# Altium schematic sheet S7CAS-PLEIADES-CARTE-MERE_P01_CAN.SchDoc
size Tabloid; DocumentNumber: 7; SheetNumber: 7; SheetTotal: 17; Sheet_Name: CAN; Size: 11x17
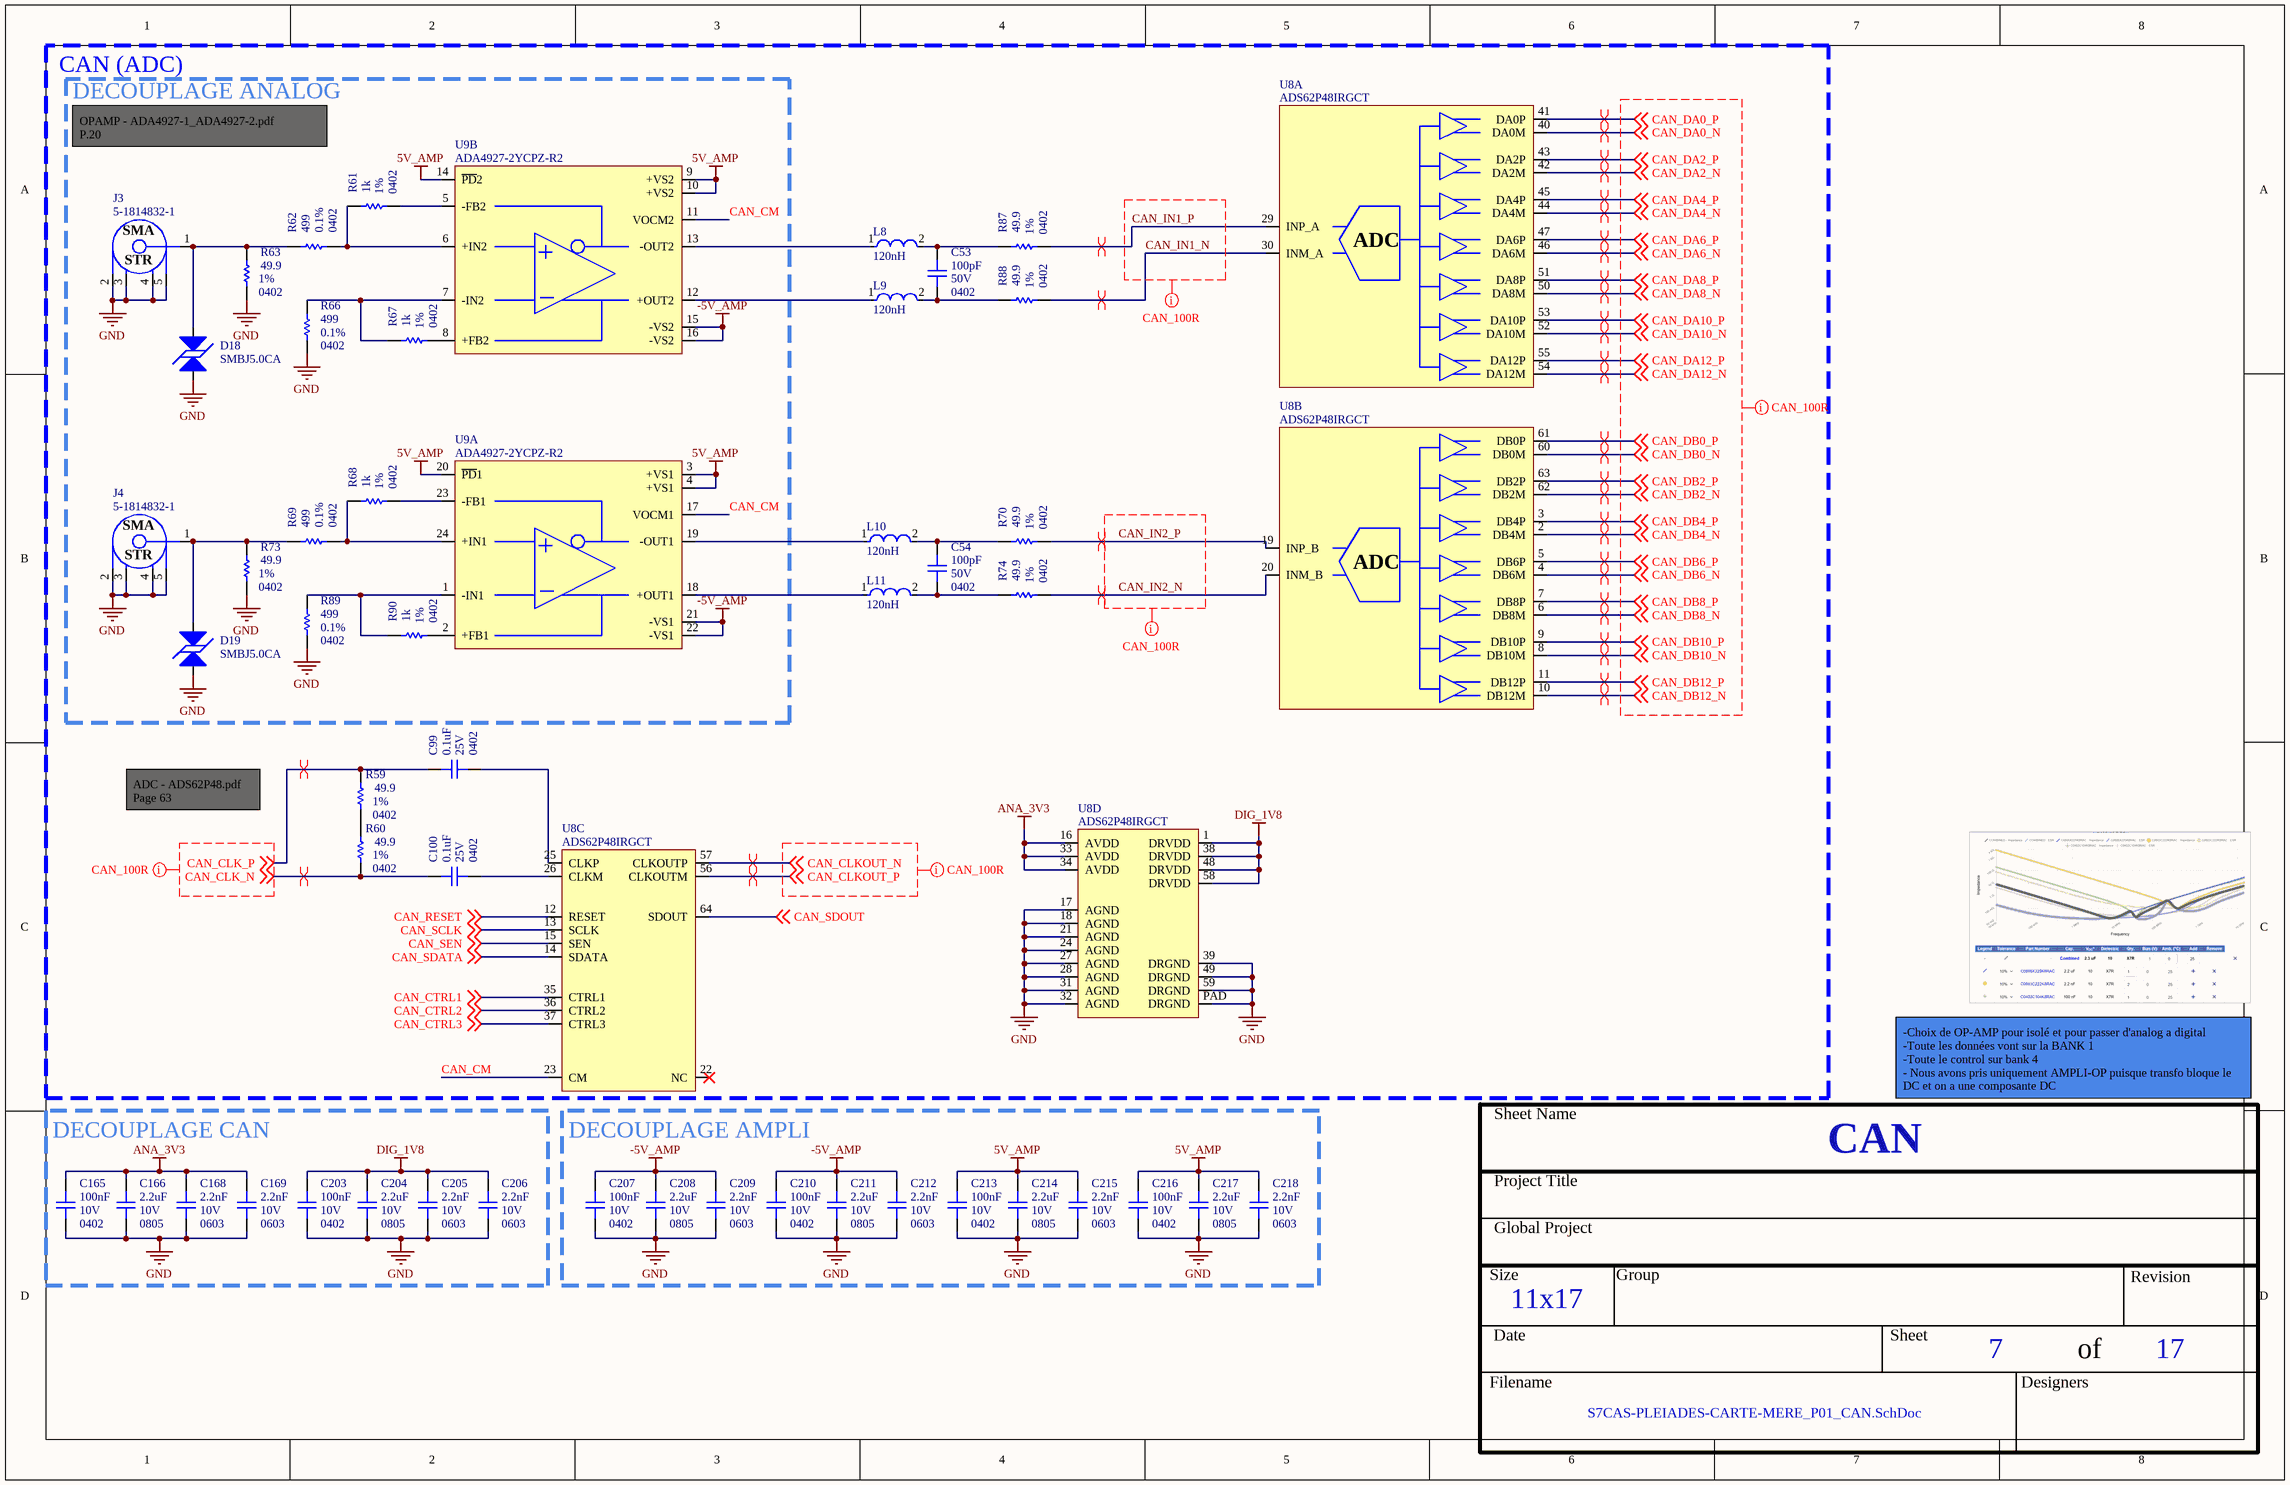
[diagram p0: S7CAS-PLEIADES-CARTE-MERE_P01_CAN.SchDoc]

## Parts
C53  value 100pF  Voltage: 50V  Package: 0402  [CAP_0402]  (hidden comment: CAP - 0402)
C54  value 100pF  Voltage: 50V  Package: 0402  [CAP_0402]  (hidden comment: CAP - 0402)
C99  value 0.1uF  Voltage: 25V  Package: 0402  [CAP_0402]  (hidden comment: CAP - 0402)
C100  value 0.1uF  Voltage: 25V  Package: 0402  [CAP_0402]  (hidden comment: CAP - 0402)
C165  value 100nF  Voltage: 10V  Package: 0402  [CAP_0402]  (hidden comment: CAP - 0402)
C166  value 2.2uF  Voltage: 10V  Package: 0805  [CAP_0805]  (hidden comment: CAP - 0805)
C168  value 2.2nF  Voltage: 10V  Package: 0603  [CAP_0603]  (hidden comment: CAP - 0603)
C169  value 2.2nF  Voltage: 10V  Package: 0603  [CAP_0603]  (hidden comment: CAP - 0603)
C203  value 100nF  Voltage: 10V  Package: 0402  [CAP_0402]  (hidden comment: CAP - 0402)
C204  value 2.2uF  Voltage: 10V  Package: 0805  [CAP_0805]  (hidden comment: CAP - 0805)
C205  value 2.2nF  Voltage: 10V  Package: 0603  [CAP_0603]  (hidden comment: CAP - 0603)
C206  value 2.2nF  Voltage: 10V  Package: 0603  [CAP_0603]  (hidden comment: CAP - 0603)
C207  value 100nF  Voltage: 10V  Package: 0402  [CAP_0402]  (hidden comment: CAP - 0402)
C208  value 2.2uF  Voltage: 10V  Package: 0805  [CAP_0805]  (hidden comment: CAP - 0805)
C209  value 2.2nF  Voltage: 10V  Package: 0603  [CAP_0603]  (hidden comment: CAP - 0603)
C210  value 100nF  Voltage: 10V  Package: 0402  [CAP_0402]  (hidden comment: CAP - 0402)
C211  value 2.2uF  Voltage: 10V  Package: 0805  [CAP_0805]  (hidden comment: CAP - 0805)
C212  value 2.2nF  Voltage: 10V  Package: 0603  [CAP_0603]  (hidden comment: CAP - 0603)
C213  value 100nF  Voltage: 10V  Package: 0402  [CAP_0402]  (hidden comment: CAP - 0402)
C214  value 2.2uF  Voltage: 10V  Package: 0805  [CAP_0805]  (hidden comment: CAP - 0805)
C215  value 2.2nF  Voltage: 10V  Package: 0603  [CAP_0603]  (hidden comment: CAP - 0603)
C216  value 100nF  Voltage: 10V  Package: 0402  [CAP_0402]  (hidden comment: CAP - 0402)
C217  value 2.2uF  Voltage: 10V  Package: 0805  [CAP_0805]  (hidden comment: CAP - 0805)
C218  value 2.2nF  Voltage: 10V  Package: 0603  [CAP_0603]  (hidden comment: CAP - 0603)
D18  SMBJ5.0CA  [TVS_PWR_SMBJ5.0CA]
D19  SMBJ5.0CA  [TVS_PWR_SMBJ5.0CA]
J3  5-1814832-1  [CONN_SMA_5-1814832-1]
J4  5-1814832-1  [CONN_SMA_5-1814832-1]
L8  120nH  [FP-0603HP-MFG]
L9  120nH  [FP-0603HP-MFG]
L10  120nH  [FP-0603HP-MFG]
L11  120nH  [FP-0603HP-MFG]
R59  value 49.9  Package: 0402  Precision: 1%  [RES_0402]  (hidden comment: RES - 0402)
R60  value 49.9  Package: 0402  Precision: 1%  [RES_0402]  (hidden comment: RES - 0402)
R61  value 1k  Package: 0402  Precision: 1%  [RES_0402]  (hidden comment: RES - 0402)
R62  value 499  Package: 0402  Precision: 0.1%  [RES_0402]  (hidden comment: RES - 0402)
R63  value 49.9  Package: 0402  Precision: 1%  [RES_0402]  (hidden comment: RES - 0402)
R66  value 499  Package: 0402  Precision: 0.1%  [RES_0402]  (hidden comment: RES - 0402)
R67  value 1k  Package: 0402  Precision: 1%  [RES_0402]  (hidden comment: RES - 0402)
R68  value 1k  Package: 0402  Precision: 1%  [RES_0402]  (hidden comment: RES - 0402)
R69  value 499  Package: 0402  Precision: 0.1%  [RES_0402]  (hidden comment: RES - 0402)
R70  value 49.9  Package: 0402  Precision: 1%  [RES_0402]  (hidden comment: RES - 0402)
R73  value 49.9  Package: 0402  Precision: 1%  [RES_0402]  (hidden comment: RES - 0402)
R74  value 49.9  Package: 0402  Precision: 1%  [RES_0402]  (hidden comment: RES - 0402)
R87  value 49.9  Package: 0402  Precision: 1%  [RES_0402]  (hidden comment: RES - 0402)
R88  value 49.9  Package: 0402  Precision: 1%  [RES_0402]  (hidden comment: RES - 0402)
R89  value 499  Package: 0402  Precision: 0.1%  [RES_0402]  (hidden comment: RES - 0402)
R90  value 1k  Package: 0402  Precision: 1%  [RES_0402]  (hidden comment: RES - 0402)
U8  ADS62P48IRGCT  [ADC_ADS62P48IRGCT]  (parts A,B,C,D of 4)
U9  ADA4927-2YCPZ-R2  [OPAMP_ADA4927-2YCPZ-R2]  (parts A,B of 2)

## Blocks framed on the sheet
CAN (ADC): C53 C54 C99 C100 L8-L11 R59 R60 R70 R74 R87 R88 U8
DECOUPLAGE ANALOG: D18 D19 J3 J4 R61-R63 R66-R69 R73 R89 R90 U9
DECOUPLAGE CAN: C165 C166 C168 C169 C203-C206
DECOUPLAGE AMPLI: C207-C218

## Nets
5V_AMP: C213.2 C214.2 C215.2 C216.2 C217.2 C218.2 U9.3(+VS1) U9.4(+VS1) U9.9(+VS2) U9.10(+VS2) U9.14(~{PD}2) U9.20(~{PD}1)
-5V_AMP: C207.2 C208.2 C209.2 C210.2 C211.2 C212.2 U9.15(-VS2) U9.16(-VS2) U9.21(-VS1) U9.22(-VS1)
ANA_3V3: C165.2 C166.2 C168.2 C169.2 U8.16(AVDD) U8.33(AVDD) U8.34(AVDD)
DIG_1V8: C203.2 C204.2 C205.2 C206.2 U8.1(DRVDD) U8.38(DRVDD) U8.48(DRVDD) U8.58(DRVDD)
GND: C165.1 C166.1 C168.1 C169.1 C203.1 C204.1 C205.1 C206.1 C207.1 C208.1 C209.1 C210.1 C211.1 C212.1 C213.1 C214.1 C215.1 C216.1 C217.1 C218.1 D18.2 D19.2 J3.2 J3.3 J3.4 J3.5 J4.2 J4.3 J4.4 J4.5 R63.1 R66.1 R73.1 R89.1 U8.17(AGND) U8.18(AGND) U8.21(AGND) U8.24(AGND) U8.27(AGND) U8.28(AGND) U8.31(AGND) U8.32(AGND) U8.39(DRGND) U8.49(DRGND) U8.59(DRGND) U8.PAD(DRGND)
CAN_CLK_N: C100.2 R60.1 ; off-sheet CAN_CLK_N
CAN_CLK_P: C99.2 R59.2 ; off-sheet CAN_CLK_P
CAN_CLKOUT_N: U8.57(CLKOUTP) ; off-sheet CAN_CLKOUT_N
CAN_CLKOUT_P: U8.56(CLKOUTM) ; off-sheet CAN_CLKOUT_P
CAN_CM: U8.23(CM) U9.11(VOCM2) U9.17(VOCM1)
CAN_CTRL1: U8.35(CTRL1) ; off-sheet CAN_CTRL1
CAN_CTRL2: U8.36(CTRL2) ; off-sheet CAN_CTRL2
CAN_CTRL3: U8.37(CTRL3) ; off-sheet CAN_CTRL3
CAN_DA0_N: U8.40(DA0M) ; off-sheet CAN_DA0_N
CAN_DA0_P: U8.41(DA0P) ; off-sheet CAN_DA0_P
CAN_DA2_N: U8.42(DA2M) ; off-sheet CAN_DA2_N
CAN_DA2_P: U8.43(DA2P) ; off-sheet CAN_DA2_P
CAN_DA4_N: U8.44(DA4M) ; off-sheet CAN_DA4_N
CAN_DA4_P: U8.45(DA4P) ; off-sheet CAN_DA4_P
CAN_DA6_N: U8.46(DA6M) ; off-sheet CAN_DA6_N
CAN_DA6_P: U8.47(DA6P) ; off-sheet CAN_DA6_P
CAN_DA8_N: U8.50(DA8M) ; off-sheet CAN_DA8_N
CAN_DA8_P: U8.51(DA8P) ; off-sheet CAN_DA8_P
CAN_DA10_N: U8.52(DA10M) ; off-sheet CAN_DA10_N
CAN_DA10_P: U8.53(DA10P) ; off-sheet CAN_DA10_P
CAN_DA12_N: U8.54(DA12M) ; off-sheet CAN_DA12_N
CAN_DA12_P: U8.55(DA12P) ; off-sheet CAN_DA12_P
CAN_DB0_N: U8.60(DB0M) ; off-sheet CAN_DB0_N
CAN_DB0_P: U8.61(DB0P) ; off-sheet CAN_DB0_P
CAN_DB2_N: U8.62(DB2M) ; off-sheet CAN_DB2_N
CAN_DB2_P: U8.63(DB2P) ; off-sheet CAN_DB2_P
CAN_DB4_N: U8.2(DB4M) ; off-sheet CAN_DB4_N
CAN_DB4_P: U8.3(DB4P) ; off-sheet CAN_DB4_P
CAN_DB6_N: U8.4(DB6M) ; off-sheet CAN_DB6_N
CAN_DB6_P: U8.5(DB6P) ; off-sheet CAN_DB6_P
CAN_DB8_N: U8.6(DB8M) ; off-sheet CAN_DB8_N
CAN_DB8_P: U8.7(DB8P) ; off-sheet CAN_DB8_P
CAN_DB10_N: U8.8(DB10M) ; off-sheet CAN_DB10_N
CAN_DB10_P: U8.9(DB10P) ; off-sheet CAN_DB10_P
CAN_DB12_N: U8.10(DB12M) ; off-sheet CAN_DB12_N
CAN_DB12_P: U8.11(DB12P) ; off-sheet CAN_DB12_P
CAN_IN1_N: R88.1 U8.30(INM_A)
CAN_IN1_P: R87.1 U8.29(INP_A)
CAN_IN2_N: R74.1 U8.20(INM_B)
CAN_IN2_P: R70.1 U8.19(INP_B)
CAN_RESET: U8.12(RESET) ; off-sheet CAN_RESET
CAN_SCLK: U8.13(SCLK) ; off-sheet CAN_SCLK
CAN_SDATA: U8.14(SDATA) ; off-sheet CAN_SDATA
CAN_SDOUT: U8.64(SDOUT) ; off-sheet CAN_SDOUT
CAN_SEN: U8.15(SEN) ; off-sheet CAN_SEN
NetC53_1: C53.1 L9.2 R88.2
NetC53_2: C53.2 L8.2 R87.2
NetC54_1: C54.1 L11.2 R74.2
NetC54_2: C54.2 L10.2 R70.2
NetC99_1: C99.1 U8.25(CLKP)
NetC100_1: C100.1 U8.26(CLKM)
NetD18_1: D18.1 J3.1 R62.2 R63.2
NetD19_1: D19.1 J4.1 R69.2 R73.2
NetL8_1: L8.1 U9.13(-OUT2)
NetL9_1: L9.1 U9.12(+OUT2)
NetL10_1: L10.1 U9.19(-OUT1)
NetL11_1: L11.1 U9.18(+OUT1)
NetR59_1: R59.1 R60.2
NetR61_1: R61.1 U9.5(-FB2)
NetR61_2: R61.2 R62.1 U9.6(+IN2)
NetR66_2: R66.2 R67.2 U9.7(-IN2)
NetR67_1: R67.1 U9.8(+FB2)
NetR68_1: R68.1 U9.23(-FB1)
NetR68_2: R68.2 R69.1 U9.24(+IN1)
NetR89_2: R89.2 R90.2 U9.1(-IN1)
NetR90_1: R90.1 U9.2(+FB1)

Not connected (* = marked no-connect by the designer): U8 22(NC)*

## Layout directives
net class CAN_100R: CAN_CLK_N, CAN_CLK_P, CAN_CLKOUT_N, CAN_CLKOUT_P, CAN_DA0_N, CAN_DA0_P, CAN_DA2_N, CAN_DA2_P, CAN_DA4_N, CAN_DA4_P, CAN_DA6_N, CAN_DA6_P, CAN_DA8_N, CAN_DA8_P, CAN_DA10_N, CAN_DA10_P, CAN_DA12_N, CAN_DA12_P, CAN_DB0_N, CAN_DB0_P, CAN_DB2_N, CAN_DB2_P, CAN_DB4_N, CAN_DB4_P, CAN_DB6_N, CAN_DB6_P, CAN_DB8_N, CAN_DB8_P, CAN_DB10_N, CAN_DB10_P, CAN_DB12_N, CAN_DB12_P, CAN_IN1_N, CAN_IN1_P, CAN_IN2_N, CAN_IN2_P
differential pair: CAN_CLK_N, CAN_CLK_P, CAN_CLKOUT_N, CAN_CLKOUT_P, CAN_DA0_N, CAN_DA0_P, CAN_DA2_N, CAN_DA2_P, CAN_DA4_N, CAN_DA4_P, CAN_DA6_N, CAN_DA6_P, CAN_DA8_N, CAN_DA8_P, CAN_DA10_N, CAN_DA10_P, CAN_DA12_N, CAN_DA12_P, CAN_DB0_N, CAN_DB0_P, CAN_DB2_N, CAN_DB2_P, CAN_DB4_N, CAN_DB4_P, CAN_DB6_N, CAN_DB6_P, CAN_DB8_N, CAN_DB8_P, CAN_DB10_N, CAN_DB10_P, CAN_DB12_N, CAN_DB12_P, CAN_IN1_N, CAN_IN1_P, CAN_IN2_N, CAN_IN2_P

## Notes on the sheet
- OPAMP - ADA4927-1_ADA4927-2.pdf
  P.20
- ADC - ADS62P48.pdf
  Page 63
- -Choix de OP-AMP pour isolé et pour passer d'analog a digital
  -Toute les données vont sur la BANK 1
  -Toute le control sur bank 4
  - Nous avons pris uniquement AMPLI-OP puisque transfo bloque le DC et on a une composante DC
- Sheet Name
- Project Title
- Global Project
- Size
- Group
- Revision
- Date
- Sheet
- of
- Filename
- Designers
- (in symbol ADC_ADS62P48IRGCT, part A) ADC
- (in symbol ADC_ADS62P48IRGCT, part B) ADC
- (in symbol CONN_SMA_5-1814832-1) SMA; STR

## Library data of the parts
C53 C54 = CAP - 0402: 100 pF ±5% 50V Ceramic Capacitor C0G, NP0 0603 (1608 Metric); Mfg Part Number: GRM1885C1H101JA01D; Mfg: Murata Electronics; Current: *; CreatedBy: Jonathan Bouchard; Power: *; Precision: 5%
C99 C100 = CAP - 0402: 0.1 µF ±10% 25V Ceramic Capacitor X7R 0402 (1005 Metric); Mfg Part Number: CL05B104KA5NNNC; Mfg: Samsung Electro-Mechanics; Current: *; CreatedBy: Jonathan Bouchard; Power: *; Precision: 10%; Part Number #1: CL05B104KA5NNNC
C165 C203 C207 C210 C213 C216 = CAP - 0402: Mfg Part Number: C0402C104K8RAC; Precision: 10%; Current: *; CreatedBy: Jonathan Bouchard; Power: *
C166 C204 C208 C211 C214 C217 = CAP - 0805: Mfg Part Number: C0805C225K8RAC; Precision: 10%; Current: *; CreatedBy: Jonathan Bouchard; Power: *
C168 C169 C205 C206 C209 C212 C215 C218 = CAP - 0603: Mfg Part Number: C0603X222K8RAC; Precision: 10%; Current: *; CreatedBy: Jonathan Bouchard; Power: *
D18 D19 = TVS_PWR_SMBJ5.0CA: TVS - BIDIR 5V 9.2V 600W - DO214AA; Manufacturer #1: Littelfuse Inc.; Value: Vbr = 6.4V -  Clamp = 9.2V; Voltage Rating: 5V Standoff; Current Rating: 65.3 A (Ipp); Power Max: 600W (Pppm); GRAMS Lib Spec: 2.8; Magnetic Material: UNKNOWN; Polarized: NO; Tolerance: *; HelpURL: http://www.littelfuse.com/~/media/electronics/datasheets/tvs_diodes/littelfuse_tvs_diode_smbj_datasheet.pdf.pdf; CreatedBy/Date: Jonathan Bouchard - 2019-03-22; VerifiedBy: Nicolas V. (2019-05-06); Temperature: -65°C ~ 150°C (TJ); Package: DO214AA; Manufacturer #2: *; Note: *; Assembly Type: SMD; Part Number #2: *; Part Number #1: SMBJ5.0CA; Supplier 1: Digi-Key; Supplier Part Number 1: SMBJ5.0CALFCT-ND; Cryo: UNKNOWN
J3 J4 = CONN_SMA_5-1814832-1: CONN -  SMA JACK STR 50 OHM - TH; Mfg: TE Connectivity AMP Connectors; Voltage: *; Current: *; Power: *; Mfg Part Number: 5-1814832-1; HelpURL: http://www.te.com/commerce/DocumentDelivery/DDEController?Action=srchrtrv&DocNm=1814832&DocType=Customer+Drawing&DocLang=English; CreatedBy: Jonathan Bouchard; Temperature: -65°C ~ 165°C; Value: *; Precision: *; Package: TH-5; Supplier 1: Digikey; Supplier Part Number 1: A97594-ND
L8-L11 = CMP-11268-000221-1: High Q Ceramic Chip Inductors 3.3nH 5% 0.024Ohm 1900mA 0603; DC Resistance (DCR): 24mR; Test Frequency: 250MHz; Max DC Current: 1.9A; Q Factor: 104; Self Resonant Frequency: 9.6GHz; Inductance: 3.3nH; Core Material: Ceramic; Height: 0.94mm; RoHS Compliant: Yes; Width: 1.09mm; Package Quantity: 2000; Termination: SMD/SMT; Series: 0603HP; Length: 1.75mm; Lead Free: Contains Lead; Packaging: Tape and Reel; Tolerance: 5%; Min Operating Temperature: -40°C; Max Operating Temperature: 125°C; Case/Package: 0603
R59 R60 R63 R70 R73 R74 R87 R88 = RES - 0402: 49.9 Ohms ±1% 0.1W, 1/10W Chip Resistor 0402 (1005 Metric) Automotive AEC-Q200 Thick Film; Mfg Part Number: CRCW040249R9FKED; Voltage: 75V; Mfg: Vishay Dale; Current: *; CreatedBy: Jonathan Bouchard; Power: 1/10W; Part Number #1: CRCW040249R9FKED
R61 R67 R68 R90 = RES - 0402: 1 kOhms ±1% 0.1W, 1/10W Chip Resistor 0402 (1005 Metric) Automotive AEC-Q200 Thick Film; Mfg Part Number: ERJ-2RKF1001X; Voltage: 50V; Mfg: Panasonic Electronic Components; Current: *; CreatedBy: Jonathan Bouchard; Power: 1/10W; Part Number #1: ERJ-2RKF1001X
R62 R66 R69 R89 = RES - 0402: 499 Ohms ±0.1% 0.063W, 1/16W Chip Resistor 0402 (1005 Metric) Automotive AEC-Q200 Thin Film; Mfg Part Number: ERA-2AEB4990X; Voltage: TBD; Mfg: Panasonic Electronic Components; Current: *; CreatedBy: Jonathan Bouchard; Power: 1/16W
U8 = ADC_ADS62P48IRGCT: ADC - 14 BIT 210MSPS SUAL - VQFN-64; Voltage: 3.15 V ~ 3.6 V / 1.7 V ~ 1.9 V; Mfg: Texas Instruments; Precision: 14 Bit; Current: *; Power: *; Mfg Part Number: ADS62P48IRGCT; HelpURL: http://www.ti.com/lit/ds/symlink/ads62p48.pdf; CreatedBy: Jonathan Bouchard; Temperature: -40°C ~ 85°C; Value: *; Package: VQFN-64; Supplier 1: Digikey; Supplier Part Number 1: 296-24611-1-ND
U9 = OPAMP_ADA4927-2YCPZ-R2: OPAMP - CFA 2.3GHZ - QFN-24; Voltage: 4.5 V ~ 11 V, ±2.25 V ~ 5.5 V; Current: 65mA; Mfg: Analog Devices; Power: *; Mfg Part Number: ADA4927-2YCPZ-R2; HelpURL: http://www.analog.com/media/en/technical-documentation/data-sheets/ADA4927-1_4927-2.pdf; CreatedBy: Jonathan Bouchard; Temperature: -40°C ~ 105°C; Value: *; Precision: *; Package: QFN-24; Supplier 1: Digikey; Supplier Part Number 1: ADA4927-2YCPZ-R2CT-ND